# Altium project cs301_YourGroupNumber.PrjPCB
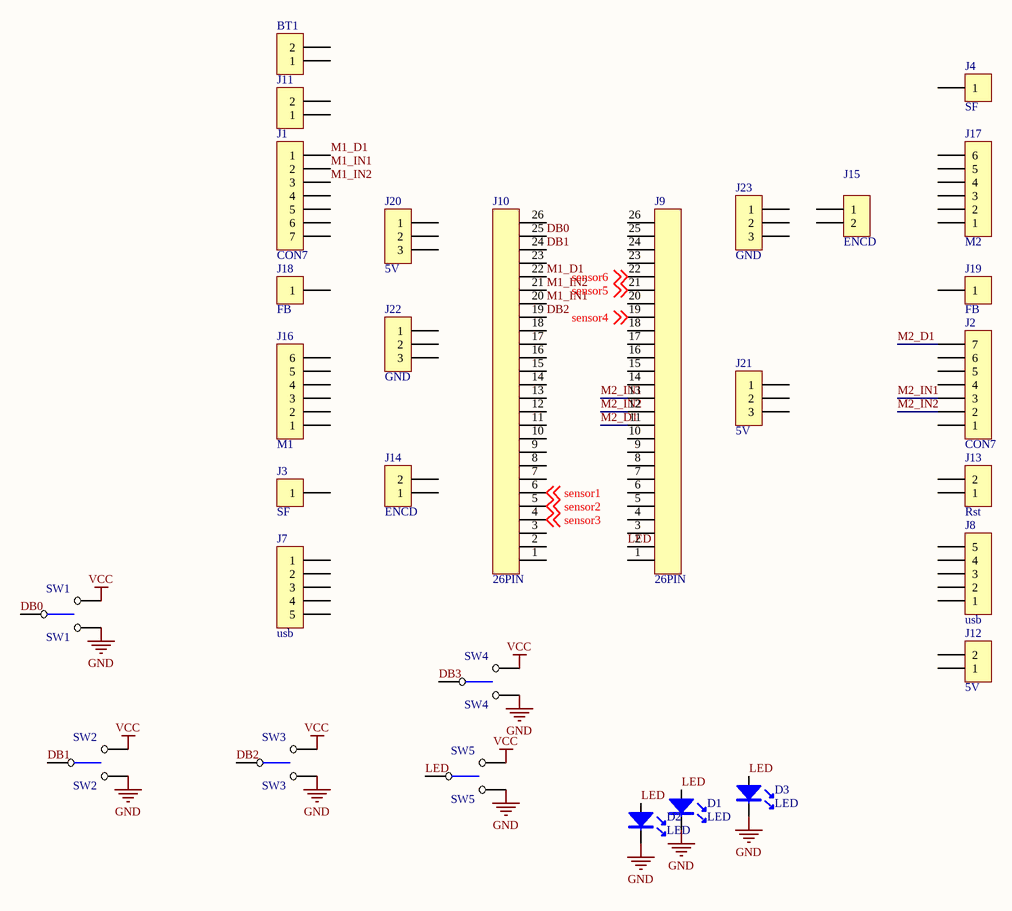
[diagram p0: cs301_YourGroupNumber.SchDoc]
2 sheets, 62 parts. Net scope: global (net labels, ports and power ports of the same name join across sheets).
Board file: cs301_YourGroupNumber.PcbDoc
Sheets:
  cs301_YourGroupNumber.SchDoc
  Sheet1.SchDoc

## Sheet cs301_YourGroupNumber.SchDoc
size A4

### Parts
BT1  Battery  [sip2]  (value not drawn)
D1  LED  [LED0.1/5MM]
D2  LED  [LED0.1/5MM]
D3  LED  [LED0.1/5MM]
J1  CON7  [SIP7]
J2  CON7  [SIP7]
J3  SF  [SIP1/0.6]
J4  SF  [SIP1/0.6]
J7  usb  [SIP5]
J8  usb  [SIP5]
J9  26PIN  [SIP26]
J10  26PIN  [SIP26]
J11  Battery  [sip2]  (value not drawn)
J12  5V  [sip2]
J13  Rst  [sip2]
J14  ENCD  [sip2]
J15  ENCD  [sip2]
J16  M1  [sip6]
J17  M2  [sip6]
J18  FB  [SIP1/0.6]
J19  FB  [SIP1/0.6]
J20  5V  [sip3]
J21  5V  [sip3]
J22  GND  [sip3]
J23  GND  [sip3]
SW1  SW1  [SW-SPDT]
SW2  SW2  [SW-SPDT]
SW3  SW3  [SW-SPDT]
SW4  SW4  [SW-SPDT]
SW5  SW5  [SW-SPDT]

### Nets
GND: D1.K D2.K D3.K SW1.3 SW2.3 SW3.3 SW4.3 SW5.3
VCC: SW1.1 SW2.1 SW3.1 SW4.1 SW5.1
DB0: J10.25 SW1.2
DB1: J10.24 SW2.2
DB2: J10.19 SW3.2
DB3: SW4.2
LED: D1.A D2.A D3.A J9.2 SW5.2
M1_D1: J1.1 J10.22
M1_IN1: J1.2 J10.20
M1_IN2: J1.3 J10.21
M2_D1: J2.7 J9.11
M2_IN1: J2.3 J9.13
M2_IN2: J2.2 J9.12
sensor1: J10.6 ; off-sheet sensor1
sensor2: J10.5 ; off-sheet sensor2
sensor3: J10.4 ; off-sheet sensor3
sensor4: J9.19 ; off-sheet sensor4
sensor5: J9.21 ; off-sheet sensor5
sensor6: J9.22 ; off-sheet sensor6

Not connected (* = marked no-connect by the designer): BT1 1 2; J1 4 5 6 7; J2 1 4 5 6; J3 1; J4 1; J7 1 2 3 4 5; J8 1 2 3 4 5; J9 1 3 4 5 6 7 8 9 10 14 15 16 17 18 20 23 24 25 26; J10 1 2 3 7 8 9 10 11 12 13 14 15 16 17 18 23 26; J11 1 2; J12 1 2; J13 1 2; J14 1 2; J15 1 2; J16 1 2 3 4 5 6; J17 1 2 3 4 5 6; J18 1; J19 1; J20 1 2 3; J21 1 2 3; J22 1 2 3; J23 1 2 3

### Library data of the parts
BT1 J11-J15 = CON2: Connector
J1 J2 = CON7: Connector
J3 J4 J18 J19 = CON1: Connector
J7 J8 = CON5: Connector
J16 J17 = CON6: Connector
J20-J23 = CON3: Connector
SW1-SW5 = SW-SPDT: Toggle Switch

## Sheet Sheet1.SchDoc
size A4
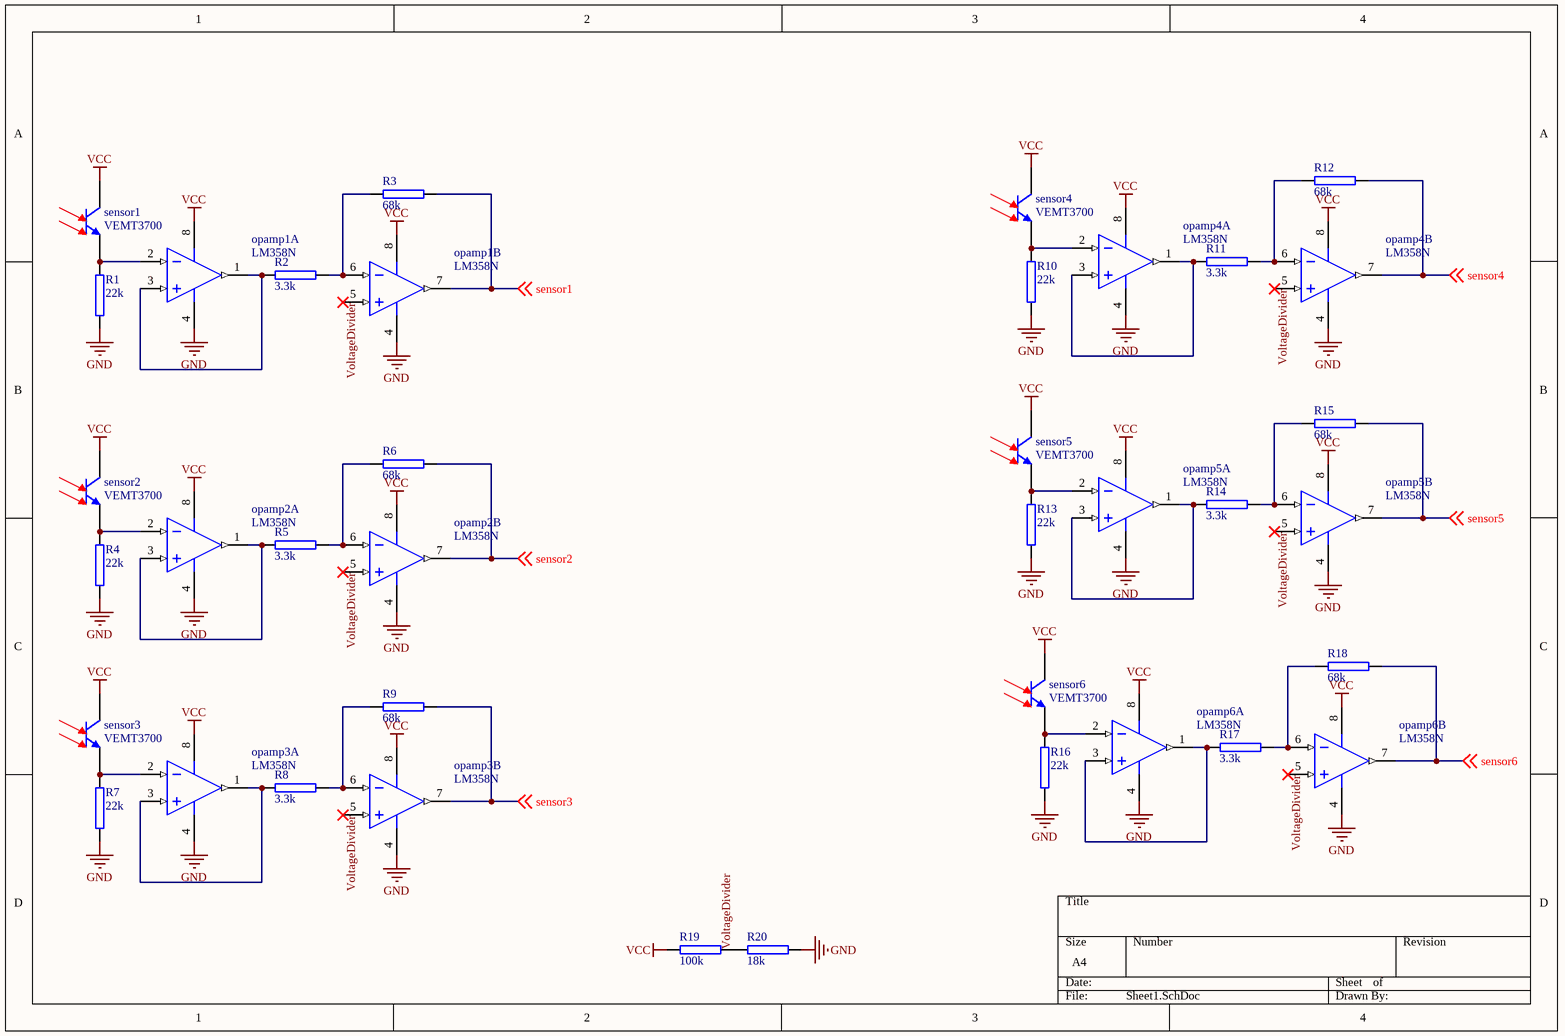
[diagram p1: Sheet1.SchDoc]

### Parts
opamp1  LM358N  [N08E]  (parts A,B of 2)
opamp2  LM358N  [N08E]  (parts A,B of 2)
opamp3  LM358N  [N08E]  (parts A,B of 2)
opamp4  LM358N  [N08E]  (parts A,B of 2)
opamp5  LM358N  [N08E]  (parts A,B of 2)
opamp6  LM358N  [N08E]  (parts A,B of 2)
R1  22k  [AXIAL0.4]
R2  3.3k  [AXIAL0.4]
R3  68k  [AXIAL0.4]
R4  22k  [AXIAL0.4]
R5  3.3k  [AXIAL0.4]
R6  68k  [AXIAL0.4]
R7  22k  [AXIAL0.4]
R8  3.3k  [AXIAL0.4]
R9  68k  [AXIAL0.4]
R10  22k  [AXIAL0.4]
R11  3.3k  [AXIAL0.4]
R12  68k  [AXIAL0.4]
R13  22k  [AXIAL0.4]
R14  3.3k  [AXIAL0.4]
R15  68k  [AXIAL0.4]
R16  22k  [AXIAL0.4]
R17  3.3k  [AXIAL0.4]
R18  68k  [AXIAL0.4]
R19  100k  [AXIAL0.4]
R20  18k  [AXIAL0.4]
sensor1  VEMT3700  [VEMT3700]
sensor2  VEMT3700  [VEMT3700]
sensor3  VEMT3700  [VEMT3700]
sensor4  VEMT3700  [VEMT3700]
sensor5  VEMT3700  [VEMT3700]
sensor6  VEMT3700  [VEMT3700]

### Nets
GND: opamp1.4(GND) opamp2.4(GND) opamp3.4(GND) opamp4.4(GND) opamp5.4(GND) opamp6.4(GND) R1.2 R4.2 R7.2 R10.2 R13.2 R16.2 R20.2
VCC: opamp1.8(V+) opamp2.8(V+) opamp3.8(V+) opamp4.8(V+) opamp5.8(V+) opamp6.8(V+) R19.2 sensor1.1(C) sensor2.1(C) sensor3.1(C) sensor4.1(C) sensor5.1(C) sensor6.1(C)
sensor1: opamp1.7(OUTB) R3.2 ; off-sheet sensor1
sensor2: opamp2.7(OUTB) R6.2 ; off-sheet sensor2
sensor3: opamp3.7(OUTB) R9.2 ; off-sheet sensor3
sensor4: opamp4.7(OUTB) R12.2 ; off-sheet sensor4
sensor5: opamp5.7(OUTB) R15.2 ; off-sheet sensor5
sensor6: opamp6.7(OUTB) R18.2 ; off-sheet sensor6
VoltageDivider: opamp1.5(INB+) opamp2.5(INB+) opamp3.5(INB+) opamp4.5(INB+) opamp5.5(INB+) opamp6.5(INB+) R19.1 R20.1
Netopamp1_1: opamp1.1(OUTA) opamp1.3(INA+) R2.1
Netopamp1_2: opamp1.2(INA-) R1.1 sensor1.2(E)
Netopamp1_6: opamp1.6(INB-) R2.2 R3.1
Netopamp2_1: opamp2.1(OUTA) opamp2.3(INA+) R5.1
Netopamp2_2: opamp2.2(INA-) R4.1 sensor2.2(E)
Netopamp2_6: opamp2.6(INB-) R5.2 R6.1
Netopamp3_1: opamp3.1(OUTA) opamp3.3(INA+) R8.1
Netopamp3_2: opamp3.2(INA-) R7.1 sensor3.2(E)
Netopamp3_6: opamp3.6(INB-) R8.2 R9.1
Netopamp4_1: opamp4.1(OUTA) opamp4.3(INA+) R11.1
Netopamp4_2: opamp4.2(INA-) R10.1 sensor4.2(E)
Netopamp4_6: opamp4.6(INB-) R11.2 R12.1
Netopamp5_1: opamp5.1(OUTA) opamp5.3(INA+) R14.1
Netopamp5_2: opamp5.2(INA-) R13.1 sensor5.2(E)
Netopamp5_6: opamp5.6(INB-) R14.2 R15.1
Netopamp6_1: opamp6.1(OUTA) opamp6.3(INA+) R17.1
Netopamp6_2: opamp6.2(INA-) R16.1 sensor6.2(E)
Netopamp6_6: opamp6.6(INB-) R17.2 R18.1

### Library data of the parts
opamp1-opamp6 = LM358N: Low Power Dual Operational Amplifier, 8-pin MDIP; Manufacturer: National Semiconductor; PackageTopMarking: NSUZXYTTE#*LM*358N; PowerWise: N; CompType: Amplifiers; Published: 4-Dec-2008; LatestRevisionDate: 13-Jan-2009; LatestRevisionNote: Sim Model Added.; DatasheetVersion: Oct-2005; PackageVersion: revG, May-2006; PackageReference: N08E; Publisher: Altium Limited; PackageDescription: MDIP, .365 x .250 x .130in, 8 Lead, .100in Pitch; Supplier 1: Farnell; Supplier Part Number 1: 9486836; Supplier 2: Farnell; Supplier Part Number 2: 1523834; PartNumber: LM358N; RoHS: N; PinCount: 8; Code_JEDEC: MS-001-BA; ComponentLink1Description: LM358 Datasheet; ComponentLink1URL: http://www.national.com/ds/LM/LM358.pdf; ComponentLink2Description: LM358 Web Page; ComponentLink2URL: http://www.national.com/pf/LM/LM358.html; ComponentLink3Description: N08E Package Page; ComponentLink3URL: http://www.national.com/packaging/folders/n08e.html
R1-R20 = RES2
sensor1-sensor6 = VEMT3700: Silicon NPN Phototransistor

## Nets that join several sheets
GND: cs301_YourGroupNumber (8 pins), Sheet1 (13 pins)
VCC: cs301_YourGroupNumber (5 pins), Sheet1 (13 pins)
sensor1: cs301_YourGroupNumber (J10.6), Sheet1 (opamp1.7 R3.2)
sensor2: cs301_YourGroupNumber (J10.5), Sheet1 (opamp2.7 R6.2)
sensor3: cs301_YourGroupNumber (J10.4), Sheet1 (opamp3.7 R9.2)
sensor4: cs301_YourGroupNumber (J9.19), Sheet1 (opamp4.7 R12.2)
sensor5: cs301_YourGroupNumber (J9.21), Sheet1 (opamp5.7 R15.2)
sensor6: cs301_YourGroupNumber (J9.22), Sheet1 (opamp6.7 R18.2)